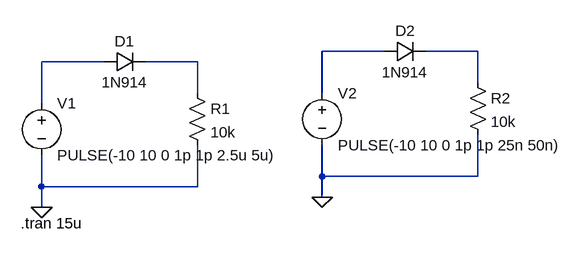
[diagram p0: schematic Simu ej#5.asc]
Simu ej#5.asc, the LTspice schematic file:
Version 4
SHEET 1 880 680
WIRE 464 48 368 48
WIRE 608 48 528 48
WIRE 32 64 -64 64
WIRE 176 64 96 64
WIRE 608 96 608 48
WIRE 176 112 176 64
WIRE 368 112 368 48
WIRE -64 128 -64 64
WIRE 368 240 368 192
WIRE 608 240 608 176
WIRE 608 240 368 240
WIRE -64 256 -64 208
WIRE 176 256 176 192
WIRE 176 256 -64 256
WIRE 368 272 368 240
WIRE -64 288 -64 256
FLAG -64 288 0
FLAG 368 272 0
SYMBOL voltage -64 112 R0
WINDOW 123 0 0 Left 0
WINDOW 39 0 0 Left 0
SYMATTR InstName V1
SYMATTR Value PULSE(-10 10 0 1p 1p 2.5u 5u)
SYMBOL res 160 96 R0
SYMATTR InstName R1
SYMATTR Value 10k
SYMBOL diode 32 80 R270
WINDOW 0 32 32 VTop 2
WINDOW 3 0 32 VBottom 2
SYMATTR InstName D1
SYMATTR Value 1N914
SYMBOL voltage 368 96 R0
WINDOW 123 0 0 Left 0
WINDOW 39 0 0 Left 0
SYMATTR InstName V2
SYMATTR Value PULSE(-10 10 0 1p 1p 25n 50n)
SYMBOL res 592 80 R0
SYMATTR InstName R2
SYMATTR Value 10k
SYMBOL diode 464 64 R270
WINDOW 0 32 32 VTop 2
WINDOW 3 0 32 VBottom 2
SYMATTR InstName D2
SYMATTR Value 1N914
TEXT -96 312 Left 2 !.tran 15u

The netlist it stands for:
* Simu ej#5.asc
V1 N003 0 PULSE(-10 10 0 1p 1p 2.5u 5u)
R1 N004 0 10k
D1 N003 N004 1N914
V2 N001 0 PULSE(-10 10 0 1p 1p 25n 50n)
R2 N002 0 10k
D2 N001 N002 1N914
.model D D
.lib standard.dio
.tran 15u
.backanno
.end